# Altium schematic sheet Sheet_1.schdoc
size 206 x 128 mm
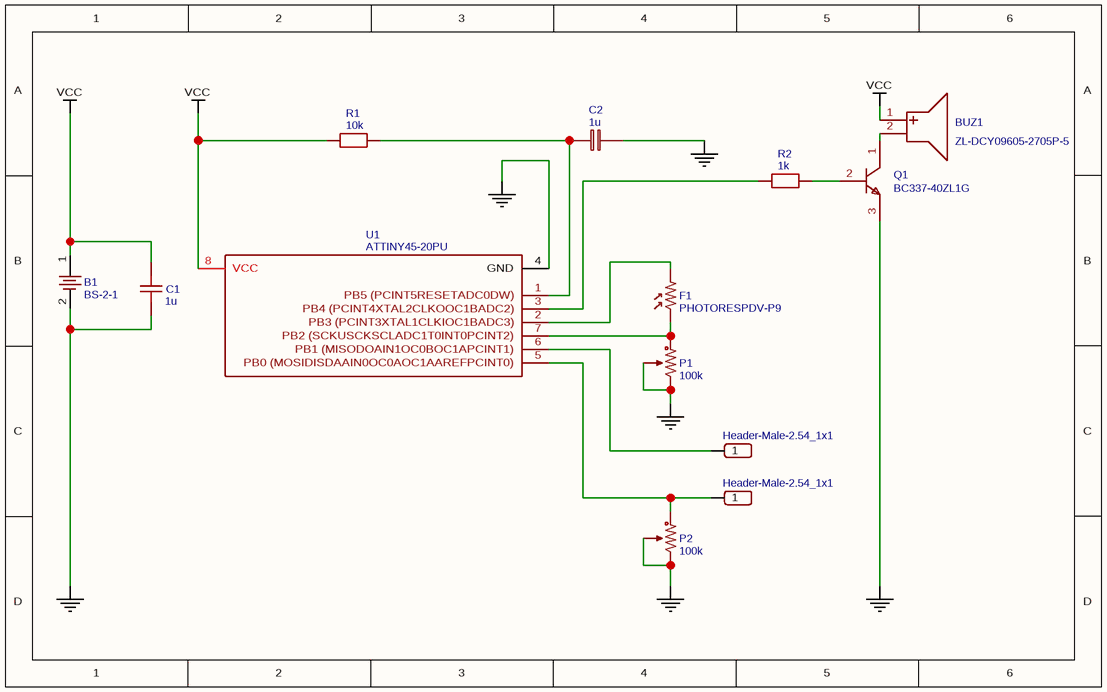
[diagram p0: Sheet_1.schdoc]

## Parts
B1  BS-2-1  [BATTERY-1]
BUZ1  ZL-DCY09605-2705P-5  [BUZZER-R9.6-2P-5.0PITCH]
C1  1u  [RAD-0.1]
C2  1u  [RAD-0.1]
CONN1  Header-Male-2.54_1x1  [HDR-1X1/2.54]
CONN2  Header-Male-2.54_1x1  [HDR-1X1/2.54]
F1  PHOTORESPDV-P9  [PDV-P9XXX]
P1  100k  [RES-ADJ_3362P]
P2  100k  [RES-ADJ_3362P]
Q1  BC337-40ZL1G  [ONSC-TO-92-3-29-11_AM_BL]
R1  10k  [AXIAL-0.3]
R2  1k  [AXIAL-0.3]
U1  ATTINY45-20PU  [DIP-8]

## Nets
GND: B1.2 C1.1 C2.2 P1.1 P1.2 P2.1 P2.2 Q1.3(E) U1.4(GND)
VCC: B1.1 BUZ1.1(+) C1.2 R1.1 U1.8(VCC)
NetBUZ1_2: BUZ1.2(-) Q1.1(C)
NetC2_1: C2.1 R1.2 U1.1(PB5_(PCINT5RESETADC0DW))
NetCONN1_1: CONN1.1 U1.6(PB1_(MISODOAIN1OC0BOC1APCINT1))
NetCONN2_1: CONN2.1 P2.3 U1.5(PB0_(MOSIDISDAAIN0OC0AOC1AAREFPCINT0))
NetF1_1: F1.1 P1.3 U1.7(PB2_(SCKUSCKSCLADC1T0INT0PCINT2))
NetF1_2: F1.2 U1.2(PB3_(PCINT3XTAL1CLKIOC1BADC3))
NetQ1_2: Q1.2(B) R2.2
NetR2_1: R2.1 U1.3(PB4_(PCINT4XTAL2CLKOOC1BADC2))

## Library data of the parts
B1 = BS-2-1: BOM_Manufacturer: Q&J; BOM_Supplier: LCSC; BOM_Manufacturer Part: BS-2-1; image: //image.lceda.cn/szlcsc/C70376.jpg; BOM_Supplier Part: C70376; spicePre: B
BUZ1 = ZL-DCY09605-2705P-5: BOM_Manufacturer: ZLFY; Contributor: LCSC; BOM_Supplier: LCSC; BOM_Supplier Part: C194534; BOM_Manufacturer Part: ZL-DCY09605-2705P-5; spicePre: B
C1 C2 = 1u: nameAlias: Value(F); BOM_Manufacturer Part: ?; spicePre: C
  C1: spiceSymbolName: Cap_RAD-0.1_US
  C2: spiceSymbolName: Cap_RAD-0.1_EU
CONN1 CONN2 = Header-Male-2.54_1x1: BOM_Manufacturer: ReliaPro; BOM_Supplier: LCSC; BOM_Manufacturer Part: Header-Male-2.54_1x1; BOM_Supplier Part: C81276; spicePre: P
P1 P2 = 100k: nameAlias: Value(Ω); Model: Potentiometer; K(%): 50; spicePre: X; BOM_Manufacturer Part: ?; spiceSymbolName: Potentiometer
Q1 = BC337-40ZL1G: description: Amplifier Transistor, NPN Silicon, 3-Pin TO-92, Pb-Free, Ammo Box; Package Display: No; BOM_Manufacturer Part: ?; spicePre: Q
R1 = 10k: nameAlias: Value(Ω); BOM_Manufacturer Part: ?; spicePre: R; spiceSymbolName: Res_AXIAL-0.3(1/8W)_EU
R2 = 1k: nameAlias: Value(Ω); BOM_Manufacturer Part: ?; spicePre: R; spiceSymbolName: Res_AXIAL-0.3(1/8W)_EU
U1 = ATTINY45-20PU: BOM_Manufacturer: MICROCHIP; Contributor: LCSC; BOM_Supplier: LCSC; BOM_Manufacturer Part: ATTINY45-20PU; BOM_Supplier Part: C152181; spicePre: U
F1 = PHOTORESPDV-P9: BOM_Manufacturer Part: ?; spicePre: R